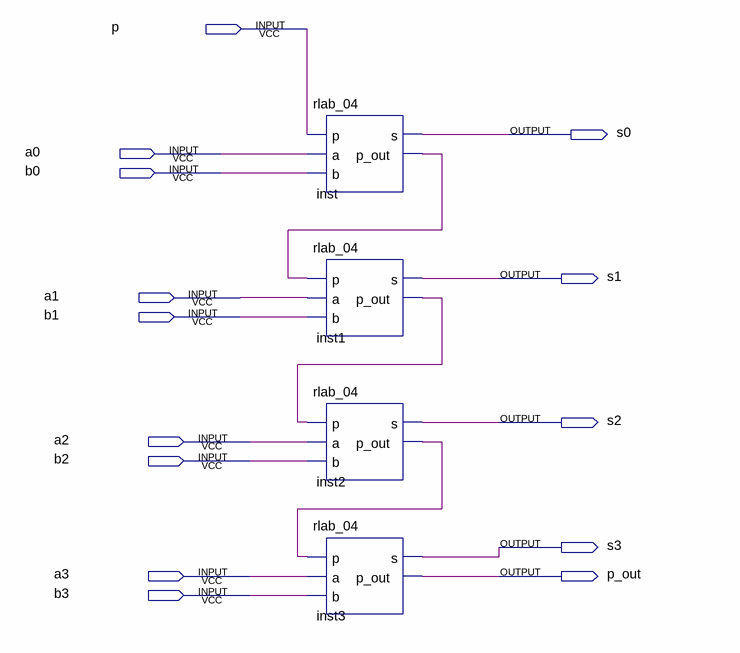
[diagram p0: schematic sheet]
// Quartus schematic sum_4.bdf as structural Verilog: 4 symbols, 14 pins
module sum_4 (
  input  p,
  input  a0,
  input  b0,
  input  a1,
  input  b1,
  input  a2,
  input  b2,
  input  a3,
  input  b3,
  output s0,
  output s1,
  output s2,
  output s3,
  output p_out
);

  wire inst1_p_out, inst2_p_out, inst_p_out;

  rlab_04 inst (.p(p), .a(a0), .b(b0), .s(s0), .p_out(inst_p_out));
  rlab_04 inst1 (.p(inst_p_out), .a(a1), .b(b1), .s(s1), .p_out(inst1_p_out));
  rlab_04 inst2 (.p(inst1_p_out), .a(a2), .b(b2), .s(s2), .p_out(inst2_p_out));
  rlab_04 inst3 (.p(inst2_p_out), .a(a3), .b(b3), .s(s3), .p_out(p_out));
endmodule
